# Altium schematic sheet untitled.SchDoc
size 297 x 209 mm
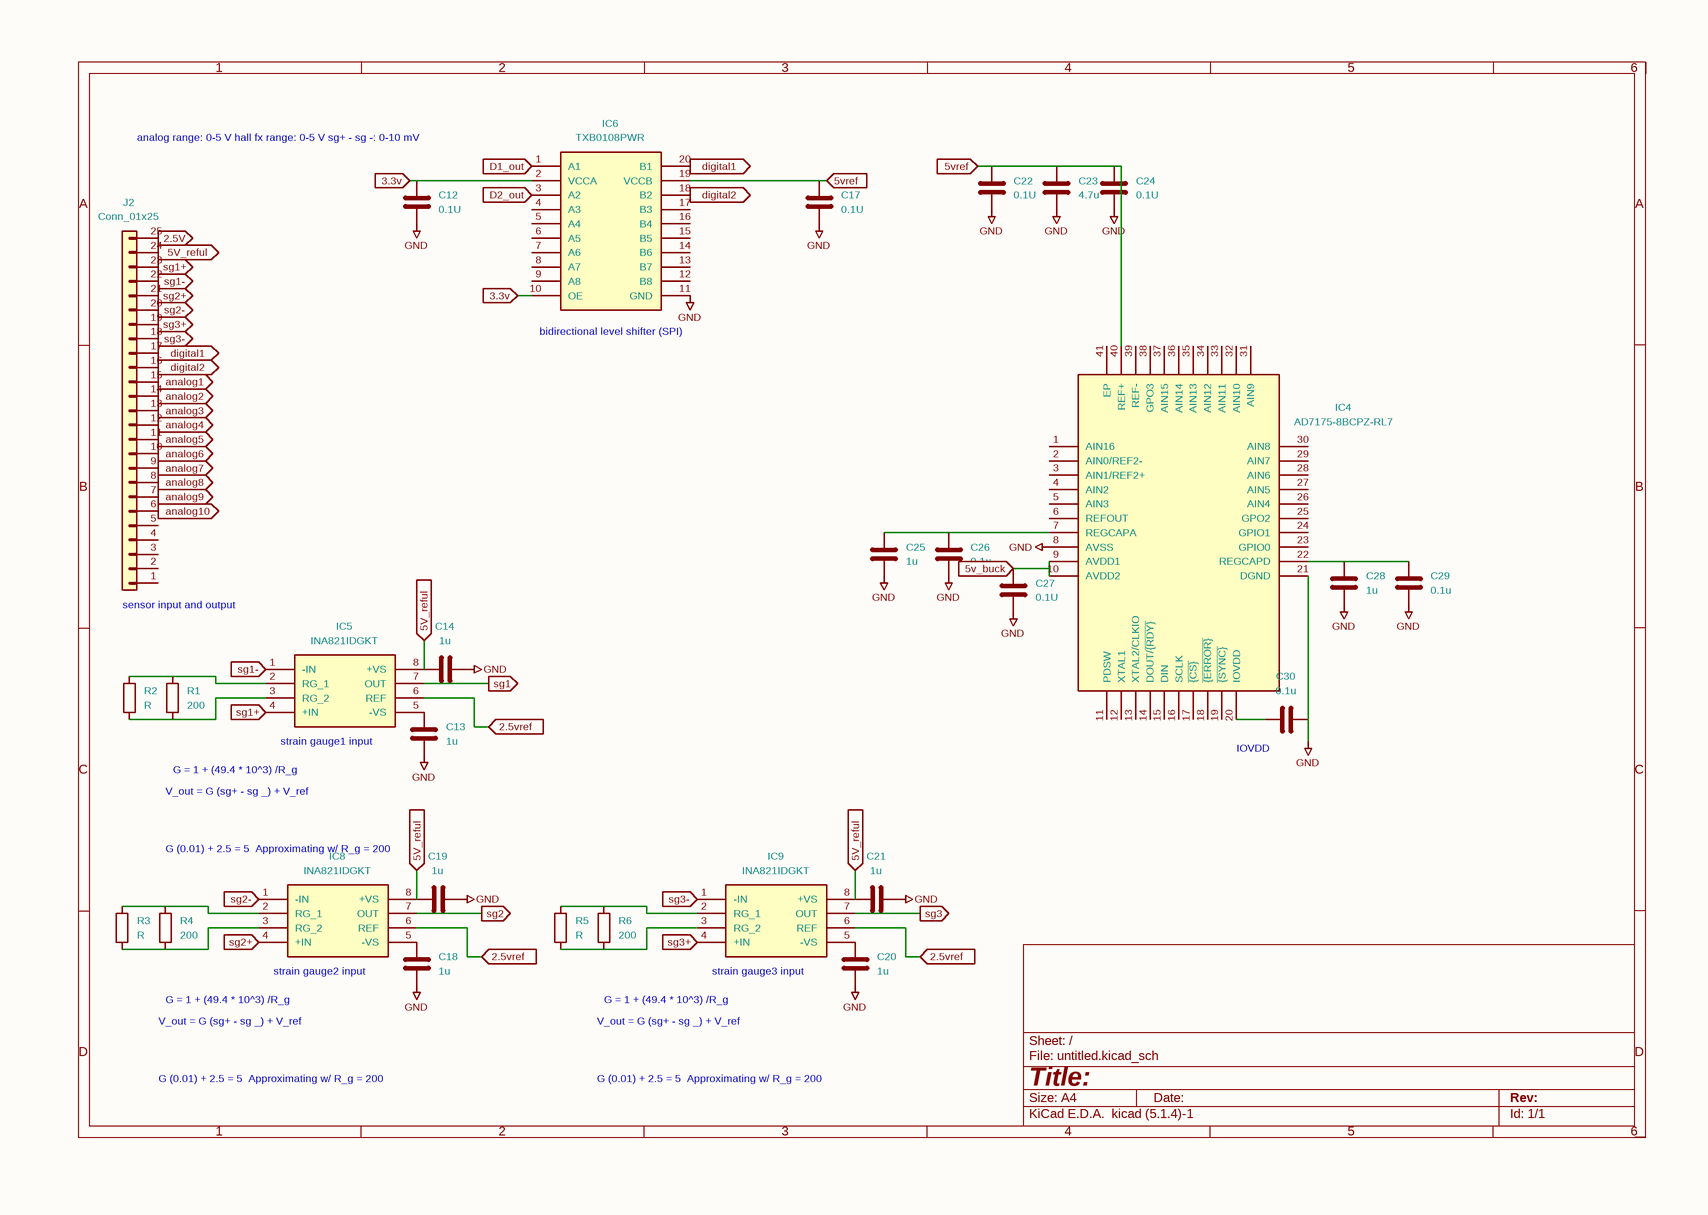
[diagram p0: untitled.SchDoc]

## Parts
C12  0.1U
C13  1u
C14  1u
C17  0.1U
C18  1u
C19  1u
C20  1u
C21  1u
C22  0.1U
C23  4.7u
C24  0.1U
C25  1u
C26  0.1u
C27  0.1U
C28  1u
C29  0.1u
C30  0.1u
IC4  AD7175-8BCPZ-RL7  [QFN50P600X600X80-41N-D]
IC5  INA821IDGKT  [SOP65P490X110-8N]
IC6  TXB0108PWR  [SOP65P640X120-20N]
IC8  INA821IDGKT  [SOP65P490X110-8N]
IC9  INA821IDGKT  [SOP65P490X110-8N]
J2  Conn_01x25
R1  200
R2  R
R3  R
R4  200
R5  R
R6  200

## Ports
2.5V (in), 2.5vref (in), 3.3v (in), 5v_buck (in), 5V_reful (in), 5vref (in), analog1 (out), analog2 (out), analog3 (out), analog4 (out), analog5 (out), analog6 (out), analog7 (out), analog8 (out), analog9 (out), analog10 (out), D1_out (out), D2_out (out), digital1 (in), digital1 (out), digital2 (in), digital2 (out), sg1 (out), sg1+ (in), sg1+ (out), sg1- (in), sg1- (out), sg2 (out), sg2+ (in), sg2+ (out), sg2- (in), sg2- (out), sg3 (out), sg3+ (in), sg3+ (out), sg3- (in), sg3- (out)

## Nets
GND: C12.2 C13.2 C14.2 C17.2 C18.2 C19.2 C20.2 C21.2 C22.2 C23.2 C24.2 C25.2 C26.2 C27.2 C28.2 C29.2 C30.2 IC4.8(AVSS) IC4.21(DGND) IC6.11(GND)
2.5V: J2.25(Pin_25) ; port 2.5V
2.5vref: IC5.6(REF) IC8.6(REF) IC9.6(REF) ; port 2.5vref
3.3v: C12.1 IC6.2(VCCA) IC6.10(OE) ; port 3.3v
5v_buck: C27.1 IC4.9(AVDD1) IC4.10(AVDD2) ; port 5v_buck
5V_reful: C14.1 C19.1 C21.1 IC5.8(+VS) IC8.8(+VS) IC9.8(+VS) J2.24(Pin_24) ; port 5V_reful
5vref: C17.1 C22.1 C23.1 C24.1 IC4.40(REF+) IC6.19(VCCB) ; port 5vref
analog1: J2.15(Pin_15) ; port analog1
analog2: J2.14(Pin_14) ; port analog2
analog3: J2.13(Pin_13) ; port analog3
analog4: J2.12(Pin_12) ; port analog4
analog5: J2.11(Pin_11) ; port analog5
analog6: J2.10(Pin_10) ; port analog6
analog7: J2.9(Pin_9) ; port analog7
analog8: J2.8(Pin_8) ; port analog8
analog9: J2.7(Pin_7) ; port analog9
analog10: J2.6(Pin_6) ; port analog10
D1_out: IC6.1(A1) ; port D1_out
D2_out: IC6.3(A2) ; port D2_out
digital1: IC6.20(B1) J2.17(Pin_17) ; port digital1
digital2: IC6.18(B2) J2.16(Pin_16) ; port digital2
sg1: IC5.7(OUT) ; port sg1
sg1+: IC5.4(+IN) J2.23(Pin_23) ; port sg1+
sg1-: IC5.1(-IN) J2.22(Pin_22) ; port sg1-
sg2: IC8.7(OUT) ; port sg2
sg2+: IC8.4(+IN) J2.21(Pin_21) ; port sg2+
sg2-: IC8.1(-IN) J2.20(Pin_20) ; port sg2-
sg3: IC9.7(OUT) ; port sg3
sg3+: IC9.4(+IN) J2.19(Pin_19) ; port sg3+
sg3-: IC9.1(-IN) J2.18(Pin_18) ; port sg3-
NetC13_1: C13.1 IC5.5(-VS)
NetC18_1: C18.1 IC8.5(-VS)
NetC20_1: C20.1 IC9.5(-VS)
NetC25_1: C25.1 C26.1 IC4.7(REGCAPA)
NetC28_1: C28.1 C29.1 IC4.22(REGCAPD)
NetC30_1: C30.1 IC4.20(IOVDD)
NetIC5_2: IC5.2(RG_1) R1.1 R2.1
NetIC5_3: IC5.3(RG_2) R1.2 R2.2
NetIC8_2: IC8.2(RG_1) R3.1 R4.1
NetIC8_3: IC8.3(RG_2) R3.2 R4.2
NetIC9_2: IC9.2(RG_1) R5.1 R6.1
NetIC9_3: IC9.3(RG_2) R5.2 R6.2

Not connected (* = marked no-connect by the designer): IC4 1(AIN16) 2(AIN0/REF2-) 3(AIN1/REF2+) 4(AIN2) 5(AIN3) 6(REFOUT) 11(PDSW) 12(XTAL1) 13(XTAL2/CLKIO) 14(DOUT/~{{RDY}}) 15(DIN) 16(SCLK) 17(~{{CS}}) 18(~{{ERROR}}) 19(~{{SYNC}}) 23(GPIO0) 24(GPIO1) 25(GPO2) 26(AIN4) 27(AIN5) 28(AIN6) 29(AIN7) 30(AIN8) 31(AIN9) 32(AIN10) 33(AIN11) 34(AIN12) 35(AIN13) 36(AIN14) 37(AIN15) 38(GPO3) 39(REF-) 41(EP); IC6 4(A3) 5(A4) 6(A5) 7(A6) 8(A7) 9(A8) 12(B8) 13(B7) 14(B6) 15(B5) 16(B4) 17(B3); J2 1(Pin_1) 2(Pin_2) 3(Pin_3) 4(Pin_4) 5(Pin_5)

## Notes on the sheet
- (near C12) analog range: 0-5 V
  hall fx range: 0-5 V
  sg+ - sg -: 0-10 mV
- (near IC6) bidirectional level shifter (SPI)
- (near J2) sensor input and output
- V_out = G (sg+ - sg _) + V_ref
- G = 1 + (49.4 * 10^3) /R_g
- (near IC5) strain gauge1 input
- (near C30) IOVDD
- G (0.01) + 2.5 = 5
  Approximating w/ R_g = 200
- (near IC8) strain gauge2 input
- (near IC9) strain gauge3 input
- 1
- 2
- 3
- 4
- 5
- 6
- A
- B
- C
- D
- Title:
- File: untitled.kicad_sch
- Sheet: /
- KiCad E.D.A.  kicad (5.1.4)-1
- Size: A4
- Date:
- Rev:
- Id: 1/1

## Library data of the parts
C12-C14 C17-C30 = C
  C12 C17 C22 C24 C27: Value: 0.1U
  C13 C14 C18-C21 C25 C28: Value: 1u
  C23: Value: 4.7u
  C26 C29 C30: Value: 0.1u
IC4 = AD7175-8BCPZ-RL7: Manufacturer_Name: Analog Devices; Height: 0.8; Mouser Part Number: 584-AD7175-8BCPZ-RL7; Mouser Price/Stock: https://www.mouser.co.uk/ProductDetail/Analog-Devices/AD7175-8BCPZ-RL7?qs=JeIcUl65ClCxXjl02vXI6Q%3D%3D; Manufacturer_Part_Number: AD7175-8BCPZ-RL7; Value: AD7175-8BCPZ-RL7
IC5 IC8 IC9 = INA821IDGKT: Manufacturer_Name: Texas Instruments; Height: 1.1; Mouser Part Number: 595-INA821IDGKT; Mouser Price/Stock: https://www.mouser.co.uk/ProductDetail/Texas-Instruments/INA821IDGKT?qs=LDGDZb5k%2F%252B8diOW5CeiHfQ%3D%3D; Manufacturer_Part_Number: INA821IDGKT; Value: INA821IDGKT
IC6 = TXB0108PWR: Manufacturer_Name: Texas Instruments; Height: 1.2; Mouser Part Number: 595-TXB0108PWR; Mouser Price/Stock: https://www.mouser.co.uk/ProductDetail/Texas-Instruments/TXB0108PWR?qs=oFXvjAmG9EgEUWGWzOVFCA%3D%3D; Manufacturer_Part_Number: TXB0108PWR; Value: TXB0108PWR
R1 R4 R6 = R: Value: 200
J2 = Conn_01x25: Value: Conn_01x25
R2 R3 R5 = R: Value: R